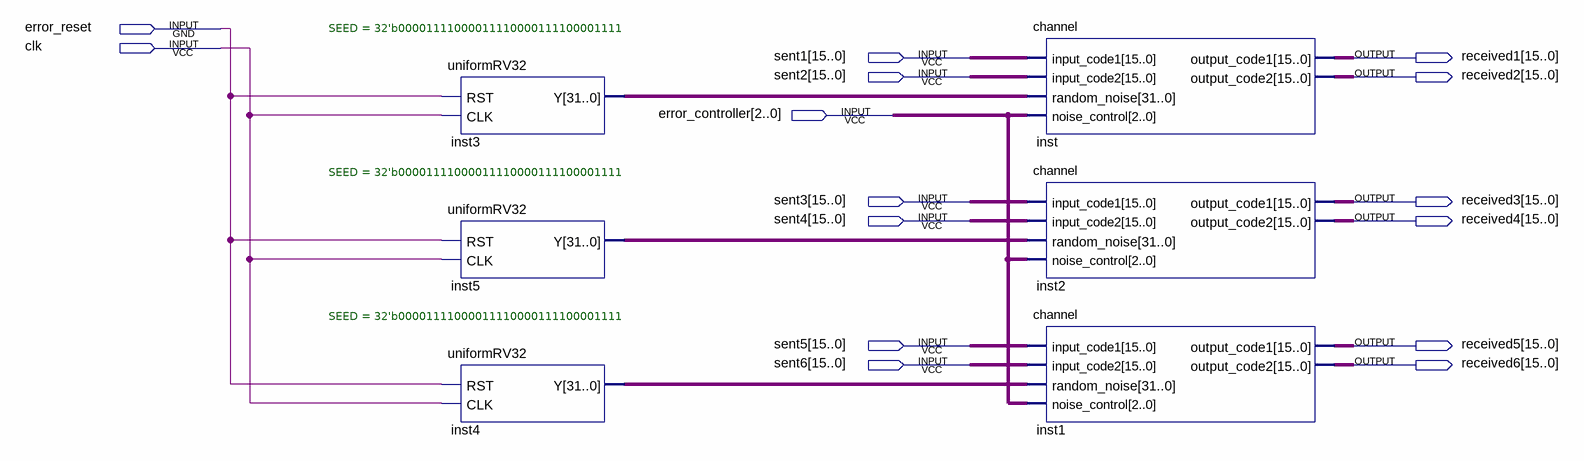
[diagram p0: schematic sheet]
// Quartus schematic full_channel.bdf as structural Verilog: 6 symbols, 15 pins
module full_channel (
  input  error_reset,
  input  clk,
  input  [15:0] sent1,
  input  [15:0] sent2,
  input  [2:0] error_controller,
  input  [15:0] sent3,
  input  [15:0] sent4,
  input  [15:0] sent5,
  input  [15:0] sent6,
  output [15:0] received1,
  output [15:0] received2,
  output [15:0] received3,
  output [15:0] received4,
  output [15:0] received5,
  output [15:0] received6
);

  wire [31:0] inst3_y, inst4_y, inst5_y;

  uniformRV32 #(.SEED(32'b00001111000011110000111100001111)) inst3 (.RST(error_reset), .CLK(clk), .Y(inst3_y));
  uniformRV32 #(.SEED(32'b00001111000011110000111100001111)) inst5 (.RST(error_reset), .CLK(clk), .Y(inst5_y));
  uniformRV32 #(.SEED(32'b00001111000011110000111100001111)) inst4 (.RST(error_reset), .CLK(clk), .Y(inst4_y));
  channel inst (
    .input_code1(sent1), .input_code2(sent2), .random_noise(inst3_y), .noise_control(error_controller),
    .output_code1(received1), .output_code2(received2));
  channel inst2 (
    .input_code1(sent3), .input_code2(sent4), .random_noise(inst5_y), .noise_control(error_controller),
    .output_code1(received3), .output_code2(received4));
  channel inst1 (
    .input_code1(sent5), .input_code2(sent6), .random_noise(inst4_y), .noise_control(error_controller),
    .output_code1(received5), .output_code2(received6));
endmodule
